# EAGLE design powerboard (EAGLE 6.5.0)
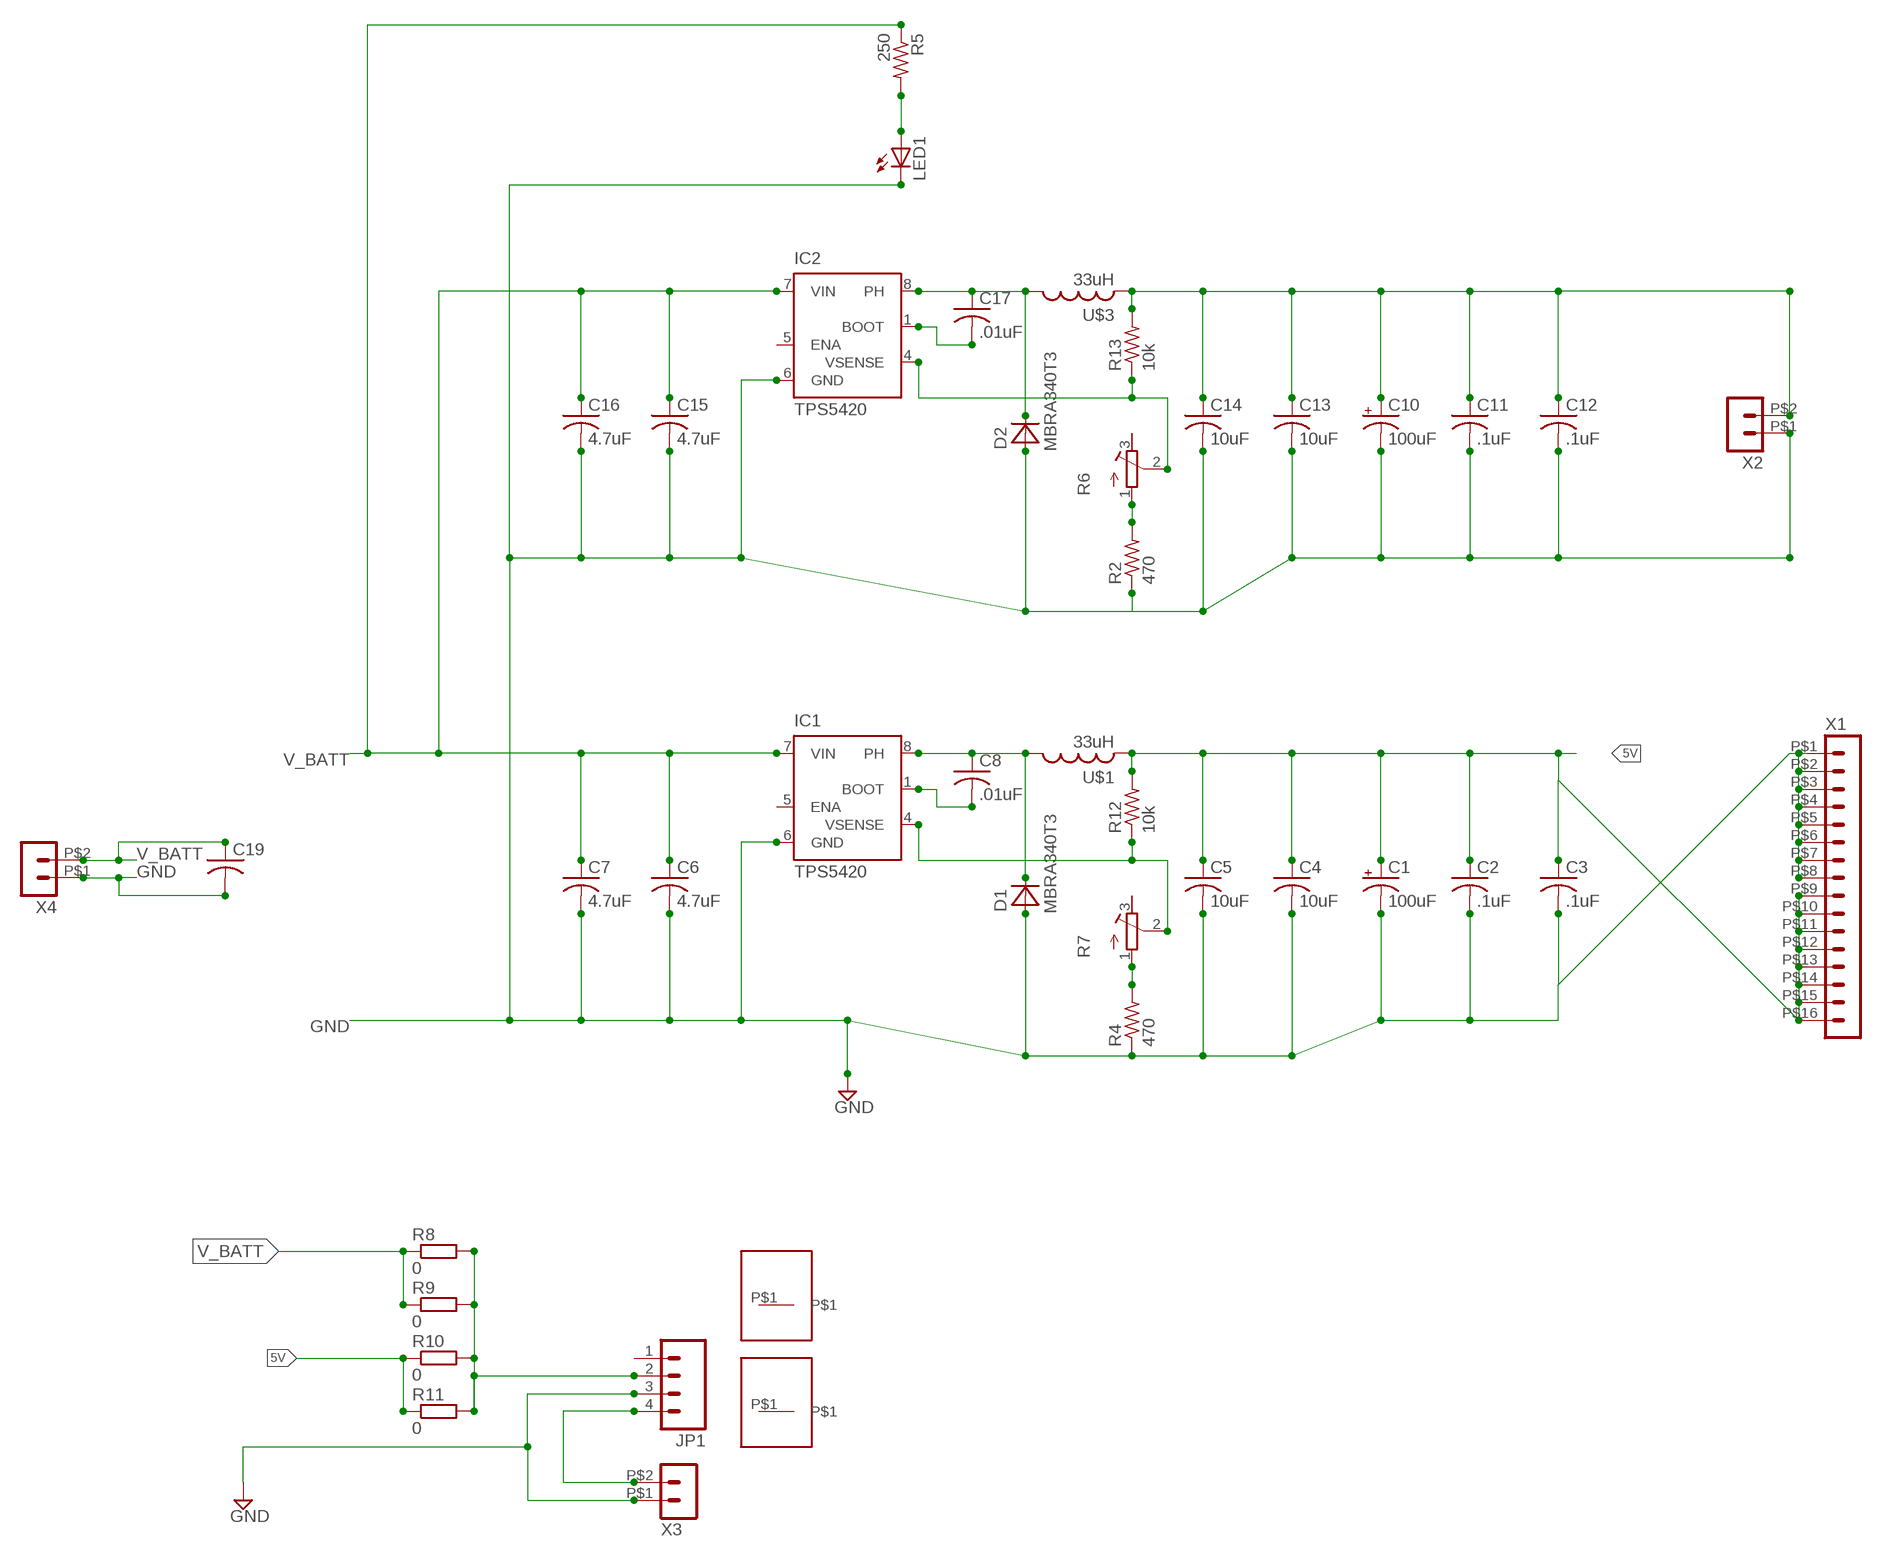
[diagram p0: schematic, sheet 1]

## Parts
C1  100uF  CPOL-USC/6032-28R  [C/6032-28R]
C2  .1uF  C-USC1206K  [C1206K]
C3  .1uF  C-USC1206K  [C1206K]
C4  10uF  C-USC1206K  [C1206K]
C5  10uF  C-USC1206K  [C1206K]
C6  4.7uF  C-USC1812K  [C1812K]
C7  4.7uF  C-USC1812K  [C1812K]
C8  .01uF  C-USC0805K  [C0805K]
C10  100uF  CPOL-USC/6032-28R  [C/6032-28R]
C11  .1uF  C-USC1206K  [C1206K]
C12  .1uF  C-USC1206K  [C1206K]
C13  10uF  C-USC1206K  [C1206K]
C14  10uF  C-USC1206K  [C1206K]
C15  4.7uF  C-USC1812K  [C1812K]
C16  4.7uF  C-USC1812K  [C1812K]
C17  .01uF  C-USC0805K  [C0805K]
C19  C-USC2220K  [C2220K]
D1  MBRA340T3  [SMA]
D2  MBRA340T3  [SMA]
IC1  TPS5420  [D_R-PDSO-G08]
IC2  TPS5420  [D_R-PDSO-G08]
JP1  M04LOCK  [1X04_LOCK]
LED1  LEDSML1206  [SML1206]
R2  470  R-US_R3216  [R3216]
R4  470  R-US_R3216  [R3216]
R5  250  R-US_R1206  [R1206]
R6  R-TRIMM3224W  [RTRIM3224W]
R7  R-TRIMM3224W  [RTRIM3224W]
R8  0  R-EU_R0805  [R0805]
R9  0  R-EU_R0805  [R0805]
R10  0  R-EU_R0805  [R0805]
R11  0  R-EU_R0805  [R0805]
R12  10k  R-US_M0805  [M0805]
R13  10k  R-US_M0805  [M0805]
U$1  33uH  MSS1260  [MSS1260]
U$2  THERMAL_PAD  [THERMAL_PAD]
U$3  33uH  MSS1260  [MSS1260]
U$4  THERMAL_PAD  [THERMAL_PAD]
X1  HEADER_POS16_43045-1606  [43045-1606]
X2  HEADER_POS2_43045-0206  [43045-0206]
X3  HEADER_POS2_43045-0206  [43045-0206]
X4  HEADER_POS2_43045-0206  [43045-0206]

## Nets
3_3V [power]: C10.+ C11.1 C12.1 C13.1 C14.1 R13.2 U$3.P$2 U$3.P$4 X2.P$2
5V [power]: C1.+ C2.1 C3.1 C4.1 C5.1 R10.1 R11.1 R12.2 U$1.P$2 U$1.P$4 X1.P$9 X1.P$10 X1.P$11 X1.P$12 X1.P$13 X1.P$14 X1.P$15 X1.P$16
6VOUT: JP1.4 X3.P$2
GND [power]: C1.- C2.2 C3.2 C4.2 C5.2 C6.2 C7.2 C10.- C11.2 C12.2 C13.2 C14.2 C15.2 C16.2 C19.2 D1.A D2.A IC1.6(GND) IC2.6(GND) JP1.3 LED1.C R2.1 R4.1 X1.P$1 X1.P$2 X1.P$3 X1.P$4 X1.P$5 X1.P$6 X1.P$7 X1.P$8 X2.P$1 X3.P$1 X4.P$1
N$2: C8.2 IC1.1(BOOT)
N$5: IC1.4(VSENSE) R7.2(S) R12.1
N$6: C8.1 D1.C IC1.8(PH) U$1.P$1 U$1.P$3
N$10: C17.2 IC2.1(BOOT)
N$12: IC2.4(VSENSE) R6.2(S) R13.1
N$13: C17.1 D2.C IC2.8(PH) U$3.P$1 U$3.P$3
N$17: LED1.A R5.2
N$18: R2.2 R6.1(A)
N$19: R4.2 R7.1(A)
V_BATT [power]: C6.1 C7.1 C15.1 C16.1 C19.1 IC1.7(VIN) IC2.7(VIN) R5.1 R8.1 R9.1 X4.P$2
VIN: JP1.2 R8.2 R9.2 R10.2 R11.2
Unconnected: IC1.5(ENA) IC2.5(ENA) JP1.1 R6.3(E) R7.3(E) U$2.P$1 U$4.P$1

## Library data of the parts
C1 C10 = rcl:CPOL-US: POLARIZED CAPACITOR, American symbol
C2-C8 C11-C17 = rcl:C-US: CAPACITOR, American symbol
C19 = custom_cap:C-US: CAPACITOR, American symbol
D1 D2 = diode:MBRA340T3: Surface Mount Schottky Power Rectifier Source: http://www.onsemi.com/pub_link/Collateral/MBRA340T3-D.PDF
IC1 IC2 = daniel:TPS5420: 1-A, WIDE INPUT RANGE, STEP-DOWN SWIFT? CONVERTER Source: U7 Texas TPS5410 Step Down Converter.pdf; MPN: TPS5410DR; OC_FARNELL: 1329596; OC_NEWARK: 18M3223
JP1 = SparkFun-Connectors:M04: Header 4 Standard 4-pin 0.1" header. Use with straight break away headers (SKU : PRT-00116), right angle break away headers (PRT-00553), swiss pins (PRT-00743), machine pins (PRT-00117), and female headers (PRT-00115). Molex polarized connector foot print use with SKU : PRT-08231 with associated crimp pins and housings. 1MM SMD Version SKU: PRT-10208
LED1 = led:LED: LED OSRAM: - CHIPLED LG R971, LG N971, LY N971, LG Q971, LY Q971, LO R971, LY R971 LH N974, LH R974 LS Q976, LO Q976, LY Q976 LO Q996 - Hyper CHIPLED LW Q18S LB Q993, LB Q99A, LB R99A - SideLED LS A670, LO A670, LY A670, LG A670, LP A670 LB A673, LV A673, LT A673, LW A673 LH A674 LY A675 LS A676, LA A676, LO A676, LY A676, LW A676 LS A679, LY A679, LG A679 - Hyper Micro SIDELED® LS Y876, LA Y876, LO Y876, LY Y876 LT Y87S - SmartLED LW L88C, LW L88S LB L89C, LB L89S, LG L890 LS L89K, LO L89K, LY L89K LS L896, LA L896, LO L896, LY L896 - TOPLED LS T670, LO T670, LY T670, LG T670, LP T670 LSG T670, LSP T670, LSY T670, LOP T670, LYG T670 LG T671, LOG T671, LSG T671 LB T673, LV T673, LT T673, LW T673 LH T674 LS T676, LA T676, LO T676, LY T676, LB T676, LH T676, LSB T676, LW T676 LB T67C, LV T67C, LT T67C, LS T67K, LO T67K, LY T67K, LW E67C LS E67B, LA E67B, LO E67B, LY E67B, LB E67C, LV E67C, LT E67C LW T67C LS T679, LY T679, LG T679 LS T770, LO T770, LY T770, LG T770, LP T770 LB T773, LV T773, LT T773, LW T773 LH T774 LS E675, LA E675, LY E675, LS T675 LS T776, LA T776, LO T776, LY T776, LB T776 LHGB T686 LT T68C, LB T68C - Hyper Mini TOPLED® LB M676 - Mini TOPLED Santana® LG M470 LS M47K, LO M47K, LY M47K Source: http://www.osram.convergy.de LUXEON: - LUMILED® LXK2-PW12-R00, LXK2-PW12-S00, LXK2-PW14-U00, LXK2-PW14-V00 LXK2-PM12-R00, LXK2-PM12-S00, LXK2-PM14-U00 LXK2-PE12-Q00, LXK2-PE12-R00, LXK2-PE12-S00, LXK2-PE14-T00, LXK2-PE14-U00 LXK2-PB12-K00, LXK2-PB12-L00, LXK2-PB12-M00, LXK2-PB14-N00, LXK2-PB14-P00, LXK2-PB14-Q00 LXK2-PR12-L00, LXK2-PR12-M00, LXK2-PR14-Q00, LXK2-PR14-R00 LXK2-PD12-Q00, LXK2-PD12-R00, LXK2-PD12-S00 LXK2-PH12-R00, LXK2-PH12-S00 LXK2-PL12-P00, LXK2-PL12-Q00, LXK2-PL12-R00 Source: www.luxeon.com KINGBRIGHT: KA-3528ASYC Source: www.kingbright.com
R2 R4 R5 R12 R13 = rcl:R-US_: RESISTOR, American symbol
R6 R7 = rcl:R-TRIMM: Trimm resistor
R8-R11 = resistor:R-EU_: RESISTOR, European symbol
U$1 U$3 = inductor-coilcraft-3:MSS1260: SMT Power Inductor
U$2 U$4 = ngohara_parts:THERMAL_PAD
X1 = con-molex-micro-fit-3_0:HEADER_POS16_?: Molex - Micro-Fit 3.0 Series connector, 3.00mm (0.118") pitch header, 16 positions.
X2-X4 = con-molex-micro-fit-3_0:HEADER_POS2_?: Molex - Micro-Fit 3.0 Series connector, 3.00mm (0.118") pitch header, 2 positions.

## Net classes
0 default: width 0.305 mm, drill 0.508 mm, clearance 0.254 mm
1 power: width 0.508 mm, drill 0.508 mm, clearance 0.508 mm

## Board
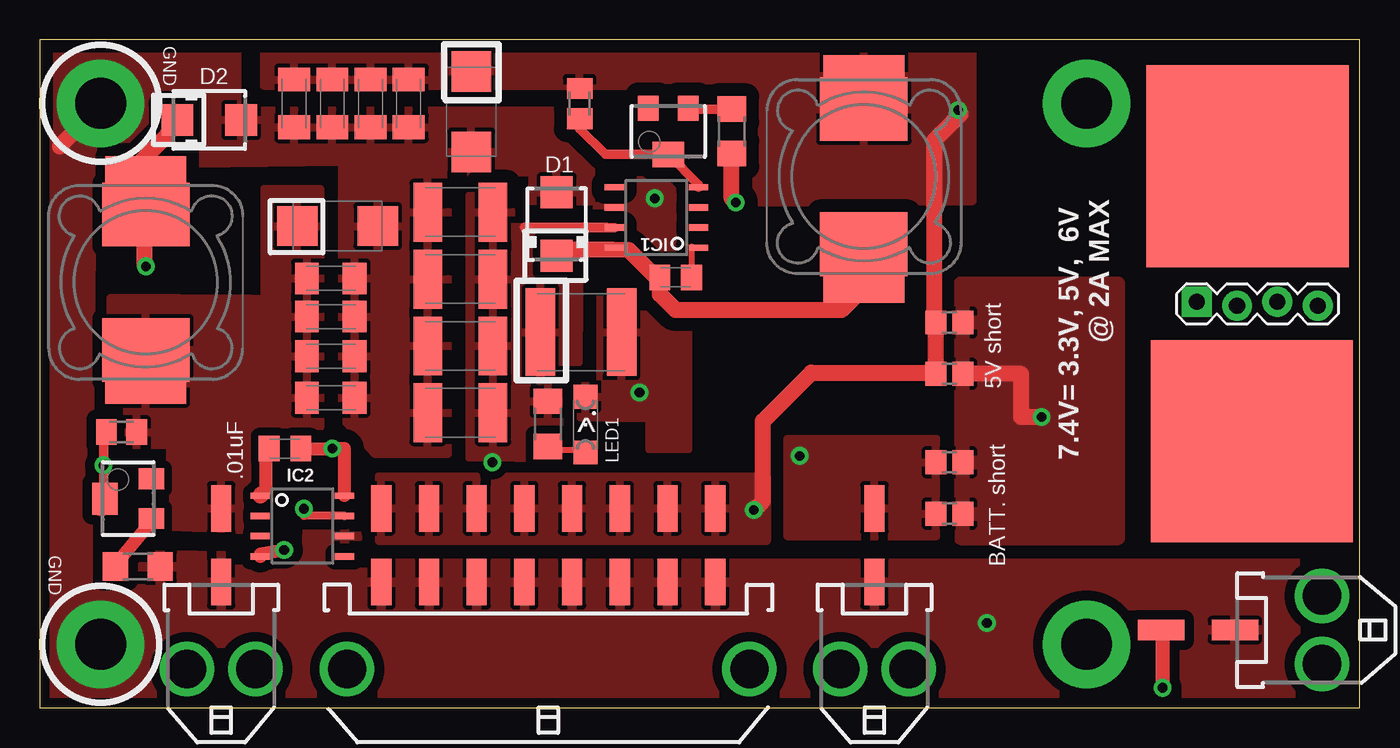
[diagram p1: board, top side]
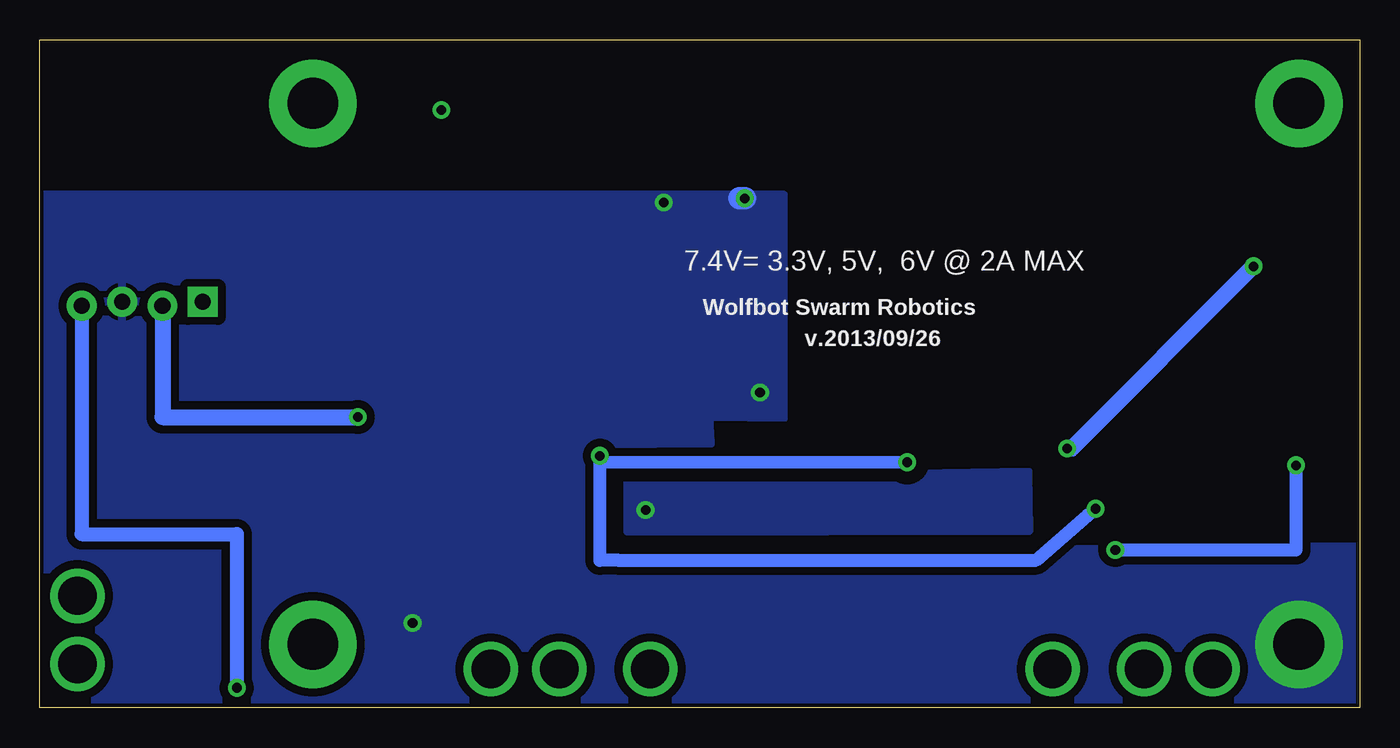
[diagram p2: board, bottom side, seen from below]

Size 83 x 42 mm. Coordinates in mm from the lower left corner, seen from the top.
Outline: 83,0 83,42 0,42 0,0 83,0
Copper layers (1*16): Top 0.035mm / dielectric 1.5mm / Bottom 0.035mm
Design rules "SparkFun": minimum track width 8mil, minimum drill 20mil, track to track 8mil, track to pad 8mil, pad to pad 8mil, via to via 8mil, smd to smd 8mil, copper to edge 10mil, drill to drill 8mil, minimum pad ring 12mil, minimum via ring 10mil, stop-mask expansion 4mil, vias tented up to drill 25mil, thermal gap 10mil

### Footprints (pad centres in the part's own frame; a part is rotated, then mirrored left to right if it is on the bottom)
C/6032-28R = smd 2.55 x 2.5: + 2.525,0; - -2.525,0
C1206K = smd 1.5 x 2: 1 -1.5,0; 2 1.5,0
C1812K = smd 1.8 x 3.7: 1 -2.05,0; 2 2.05,0
C0805K = smd 1.3 x 1.6: 1 -1,0; 2 1,0
C2220K = smd 1.85 x 5.5: 1 -2.55,0; 2 2.55,0
SMA = smd 2 x 2: A 2,0; C -2,0
D_R-PDSO-G08 = smd 0.4 x 1.2: 1 0.555,-4.66; 2 1.825,-4.66; 3 3.095,-4.66; 4 4.365,-4.66; 5 4.365,0.64; 6 3.095,0.64; 7 1.825,0.64; 8 0.555,0.64
1X04_LOCK = drill 1.016 pad 1.88 square: 1 0,0.127 | drill 1.016 pad 1.88: 2 2.54,-0.127; 3 5.08,0.127; 4 7.62,-0.127
SML1206 = smd 1.5 x 1.5: A 1.75,0; C -1.75,0
R3216 = smd 1.6 x 1.8: 1 -1.4,0; 2 1.4,0
R1206 = smd 1.6 x 1.803: 1 -1.422,0; 2 1.422,0
RTRIM3224W = smd 1.3 x 1.6: 1 -1.25,-1.45; 3 1.25,-1.45 | smd 2 x 1.6: 2 0,1.45
R0805 = smd 1.3 x 1.5: 1 -0.85,0; 2 0.85,0
M0805 = smd 1.3 x 1.6: 1 -0.95,0; 2 0.95,0
MSS1260 = smd 5.5 x 4: P$1 0,4.25; P$2 0,-4.25 | smd 5.08 x 2.54: P$3 0,6.64; P$4 0,-6.35
THERMAL_PAD = smd 12.7 x 12.7: P$1 0,0
43045-1606 = smd 1.27 x 2.92: P$1 10.5,5.47; P$2 7.5,5.47; P$3 4.5,5.47; P$4 1.5,5.47; P$5 -1.5,5.47; P$6 -4.5,5.47; P$7 -7.5,5.47; P$8 -10.5,5.47; P$9 10.5,10.1; P$10 7.5,10.1; P$11 4.5,10.1; P$12 1.5,10.1; P$13 -1.5,10.1; P$14 -4.5,10.1; P$15 -7.5,10.1; P$16 -10.5,10.1 | drill 2.41: P$17 -12.65,0; P$18 12.65,0
43045-0206 = smd 1.27 x 2.92: P$1 0,5.47; P$2 0,10.1 | drill 2.41: P$3 -2.15,0; P$4 2.15,0

### Placement (x,y rotation side)
C1  27.13,37.48 90 top
C2  23.2,38 270 top
C3  20.8,38 270 top
C4  18.4,38 270 top
C5  16,38 270 top
C6  26.45,18.56 180 top
C7  26.45,22.76 180 top
C8  39.98,27.06 0 top
C10  18.72,30.29 180 top
C11  18.3,27 0 top
C12  18.3,24.6 0 top
C13  18.3,22.1 0 top
C14  18.3,19.5 0 top
C15  26.45,31.16 180 top
C16  26.45,26.96 180 top
C17  15.42,16.31 180 top
C19  34.04,23.62 0 top
D1  32.5,30.41 90 top
D2  10.66,36.96 0 top
IC1  36.77,28.37 90 top
IC2  18.53,13.9 270 top
JP1  72.75,25.4 0 top
LED1  34.32,17.81 270 top
R2  6.17,8.89 180 top
R4  43.51,36.25 90 top
R5  31.95,17.86 270 top
R6  5.56,13.16 90 top
R7  39.52,36.25 180 top
R8  57.2,15.44 0 top
R9  57.2,12.22 0 top
R10  57.2,24.23 0 top
R11  57.2,21.01 0 top
R12  33.95,37.99 90 top
R13  5.14,17.34 0 top
U$1  51.82,33.39 180 top
U$2  75.95,34.04 0 top
U$3  6.66,26.76 0 top
U$4  76.2,16.76 0 top
X1  31.97,2.44 0 top
X2  11.4,2.44 0 top
X3  80.62,4.9 90 top
X4  52.48,2.44 0 top

### Tracks (layer width: path | path; a pad name or v marks a point on that pad's centre or on a via)
3_3V
  pour Top: 4.43,16.52 8.16,16.54 8.19,11.38 14.45,11.12 14.35,17.7 17.65,17.65 17.65,32.61 14.1,32.61 14.1,25.7 13.23,25.73 4.45,25.77
5V  (via drill 0.6)
  Top 1.016: v44.91,12.45 45.47,13.01 45.47,18.03 48.51,21.08 56.13,21.08 56.26,20.95 | 57.91,37.34 56.25,35.67 56.25,24.13 R10.1 R11.1 56.31,21.01 56.26,20.95 | 56.26,20.95 56.39,20.83
  other vias: 57.76,37.59
  pour Top (isolate 0.813): 47.12,41.53 14.07,41.45 14.07,39.12 43.84,39.12 43.84,37.41 43.92,31.75 58.67,31.85 58.67,41.63
  pour Bottom (isolate 0.813): 20.77,11.13 20.83,14.86 46.06,14.41 46.06,11.09
  pour Top: 45.72,14.55 45.72,10.49 21.34,10.49 21.34,14.58
6VOUT  (via drill 0.6)
  Top 0.889: v70.61,1.27 70.61,4.9 X3.P$2
  Bottom 0.889: JP1.4 80.37,10.92 70.61,10.92 v70.61,1.27
GND  (via drill 0.6, 3.2 pad 5.5)
  Top 1.016: v43.76,31.78 43.51,32.03 R4.1 | 1.27,35.31 4.06,38.1
  Bottom 0.61: 39,32 39,32.03
  Bottom 0.813: 38.68,32
  Bottom 1.422: 38.66,32.03 39,32.03
  other vias: 37.71,19.82 38.68,32.04 59.56,5.34 3.82,4 3.82,38
  pour Top (isolate 0.813): 19.02,34.29 0.25,34.04 0.25,41.4 12.41,41.38 12.41,37.57 41.24,37.59 41.32,35.2 39.88,35.18 39.83,24.18 40.77,24.16 40.77,16.26 38.33,16.26 38.35,18.19 34.01,18.24 34.01,20.24 35.26,20.24 35.26,25.81 37.54,25.78 37.47,31.29 35.03,31.29 35.03,31.83 30.99,31.8 30.99,33.63 25.65,33.63 25.65,15.95 21.08,15.95 19.02,18.23
  pour Top (isolate 0.61): 82.8,0.25 0.62,0.25 0.69,9.56 0.51,35.56 3.3,35.56 3.05,9.65 16.75,9.54 16.81,11.35 19.97,11.35 19.97,9.1 82.8,9.1
  pour Bottom: 82.88,32.26 82.93,-0.05 0.43,0.2 0.1,10.16 47.47,9.7 47.62,16.59 40.79,16.64 40.89,18.36 40.77,18.31 36.2,18.24 36.2,32.26
N$2
  Top 0.381: IC1.1 41,29 41,27 C8.2
N$5
  Top 0.61: IC1.4 41.43,32.89 R7.2 35.57,34.8 33.95,36.41 R12.1
N$6
  Top 0.381: 36,28.82 IC1.8 | 39.02,26.8 C8.1 | 49.63,28.24 U$1.P$1
  Top 1.016: D1.C 33,28.82 36,28.82 37.02,28.8 39.02,26.8 39,26 40,25 50.4,25 52.83,27.43 | 52.83,27.43 50.04,27.83 49.63,28.24 | 52.83,27.43 50.04,27.01 | U$1.P$3 52.83,26.75 52.83,27.43
N$10
  Top 0.381: C17.2 14,16 14.2,16
  Top 0.813: 14.2,16.2 14.2,16 14.2,13.69 13.97,13.46 13.87,13.36
  Top 1.016: IC2.1 13.87,13.36 13.97,13.46
N$11  (via drill 3.2 pad 5.5)
  other vias: 65.82,38
N$12  (via drill 0.6)
  Top 0.381: 4.02,13.25 R6.2 4.02,12.25 3.79,12.48
  Top 0.61: 4.02,13.25 v4.02,15.25 4.02,17.25 4.05,17.25 4.14,17.34 R13.1
  Top 0.813: 4.12,13.11 4.12,12.8 3.79,12.48 | IC2.4 13.87,9.68 v15.37,9.93
  Bottom 0.813: v15.37,9.93 4.02,9.93 v4.02,15.25
N$13  (via drill 0.6)
  Top 0.381: 8,36 D2.C | 6,34 U$3.P$3 7,33 7,32 U$3.P$1 7,31 6.6,30.79 | v6.68,27.76 7,28 6.6,28
  Top 0.813: 6.6,30.79 6.63,30.81 | C17.1 v18.39,16.31 19.17,16.31 IC2.8
  Top 1.016: 6,34 8,36 | 6.6,27.76 6.6,28 6.6,30.79
  Bottom 0.381: v6.68,27.76 7,28 6.72,27.72 | 18,16 18.14,16.31
  Bottom 1.016: 6.63,27.81 v6.68,27.76 6.72,27.72 18.14,16.31 v18.39,16.31
N$14  (via drill 3.2 pad 5.5)
  other vias: 65.82,4
N$17
  Top 0.381: LED1.A 34,16.24 32,16.24 R5.2
N$18
  Top 0.381: 7.27,12 R6.1 | 4.78,9 R2.2
  Top 0.813: 4.78,9 7.27,12
N$19
  Top 0.61: R7.1 40.82,37.65 R4.2
V_BATT  (via drill 0.6)
  Top 0.508: IC2.7 16.61,12.07 v16.61,12.52
  Top 0.61: 35.64,30.23 34.04,30.23 | 34.04,30.23 30.48,30.23 | IC1.7 34.04,30.19 34.04,30.23
  Bottom 0.508: v16.61,12.52 17,12 17.1,12.12
  Bottom 0.813: v28.45,15.44 47.78,15.42 v47.78,15.85 47.78,9.27 46.58,9.27 20.34,9.3 17.1,12.12 | 17.1,12.12 | 17.1,12.12 16.66,12.5
  pour Top: 46.99,16.89 46.99,10.79 56.39,10.79 56.39,16.89
  pour Top: 27.03,32.21 29.64,32.18 29.64,30.25 33.88,30.25 33.88,29.77 33.93,29.41 33.88,21.72 32.61,21.72 32.66,15.67 27.03,15.72
VIN  (via drill 0.6)
  Top 1.016: v62.99,18.29 61.72,18.29 61.72,21.01 R11.2
  Bottom 1.016: JP1.2 75.29,18.29 v62.99,18.29
  pour Top: 57.91,10.67 67.82,10.67 67.82,26.67 57.91,26.67

### Text on the board
tPlace: GND | GND
tNames: 7.4V= 3.3V, 5V, 6V / @ 2A MAX | 5V short | ^ | BATT. short
bNames: 7.4V= 3.3V, 5V, 6V @ 2A MAX | Wolfbot Swarm Robotics | v.2013/09/26